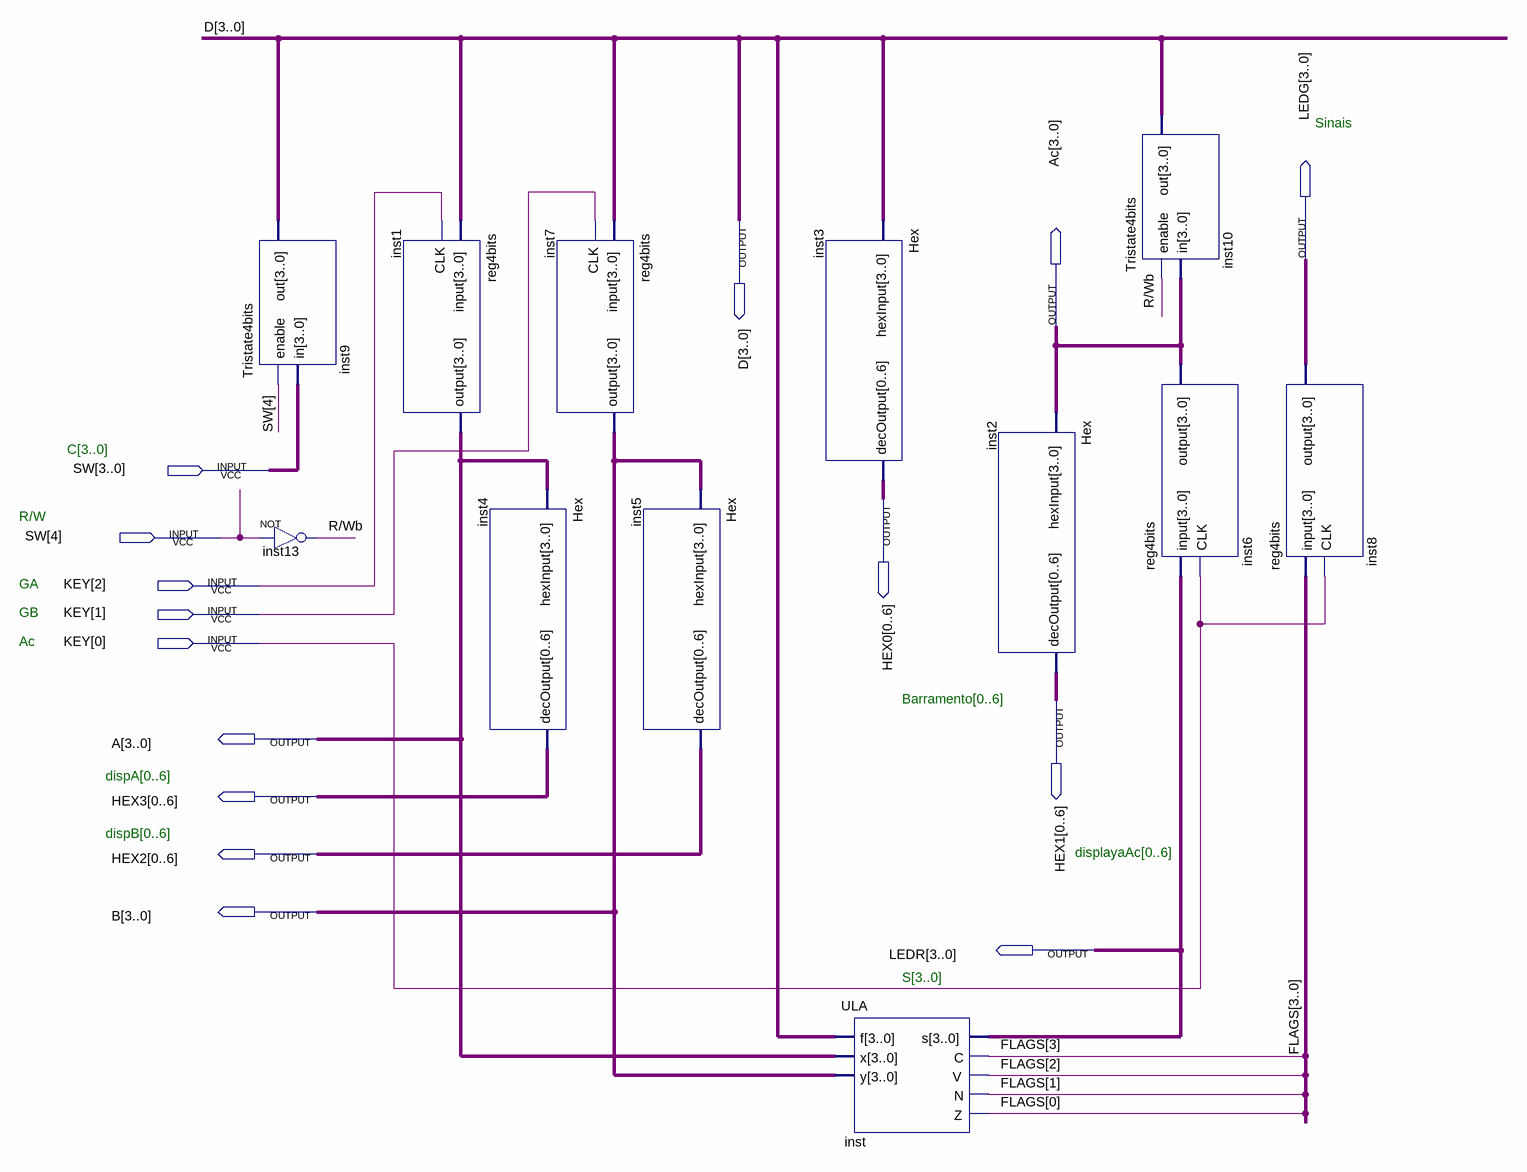
[diagram p0: schematic sheet]
// Quartus schematic Circuito.bdf as structural Verilog: 12 symbols, 15 pins
module Circuito (
  input  [4:0] SW,
  input  [2:0] KEY,
  output [3:0] D,
  output [3:0] LEDG,
  output [3:0] Ac,
  output [0:6] HEX0,
  output [0:6] HEX1,
  output [3:0] A,
  output [0:6] HEX3,
  output [0:6] HEX2,
  output [3:0] B,
  output [3:0] LEDR
);

  wire \R/Wb ;
  wire [3:0] FLAGS;

  Tristate4bits inst9 (.enable(SW[4]), .in(SW[3:0]), .out(D));
  not inst13 (\R/Wb , SW[4]);
  reg4bits inst1 (.\input (D), .CLK(KEY[2]), .\output (A));
  Hex inst4 (.hexInput(A), .decOutput(HEX3));
  reg4bits inst7 (.\input (D), .CLK(KEY[1]), .\output (B));
  Hex inst5 (.hexInput(B), .decOutput(HEX2));
  Hex inst3 (.hexInput(D), .decOutput(HEX0));
  ULA inst (.f(D), .x(A), .y(B), .s(LEDR), .C(FLAGS[3]), .V(FLAGS[2]), .N(FLAGS[1]), .Z(FLAGS[0]));
  Hex inst2 (.hexInput(Ac), .decOutput(HEX1));
  Tristate4bits inst10 (.enable(\R/Wb ), .in(Ac), .out(D));
  reg4bits inst6 (.\input (LEDR), .CLK(KEY[0]), .\output (Ac));
  reg4bits inst8 (.\input (FLAGS), .CLK(KEY[0]), .\output (LEDG));

  // Notes on the sheet:
  //   Sinais
  //   C[3..0]
  //   R/W
  //   GA
  //   GB
  //   Ac
  //   Barramento[0..6]
  //   dispA[0..6]
  //   dispB[0..6]
  //   displayaAc[0..6]
  //   S[3..0]
endmodule
